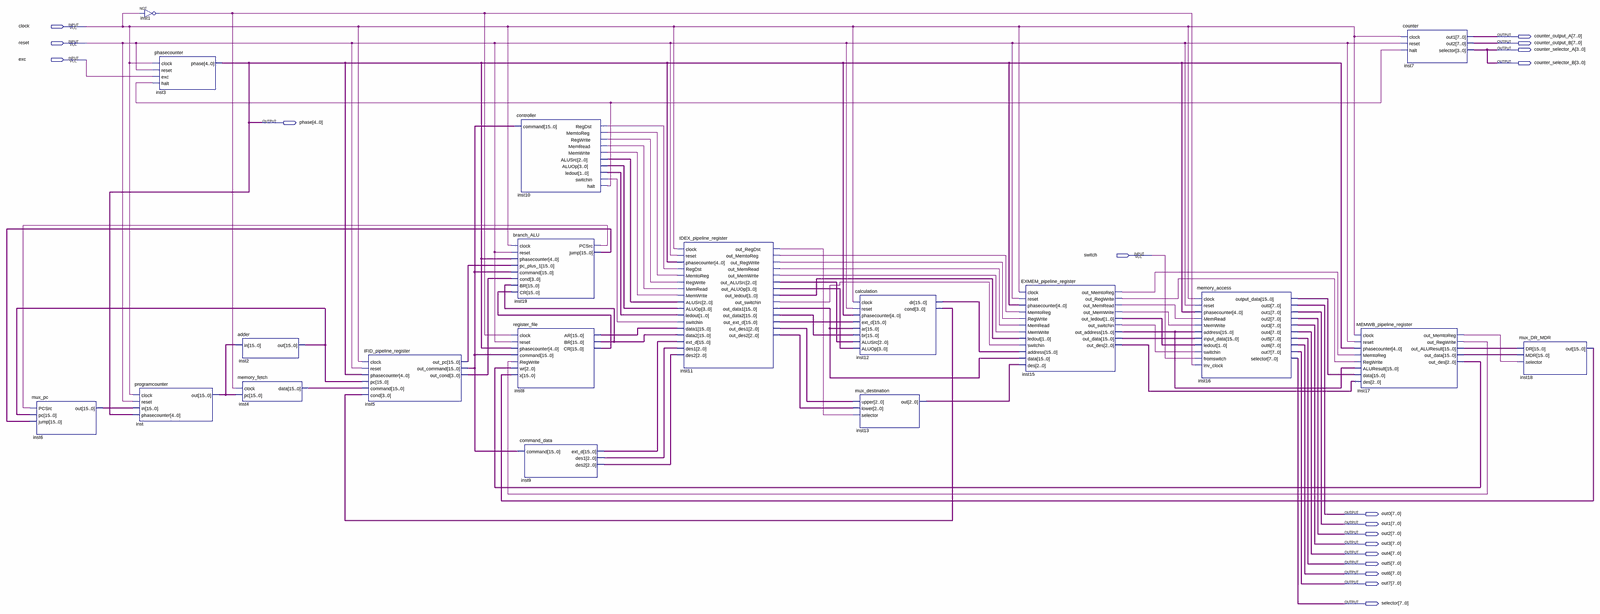
[diagram p0: schematic sheet, whole]
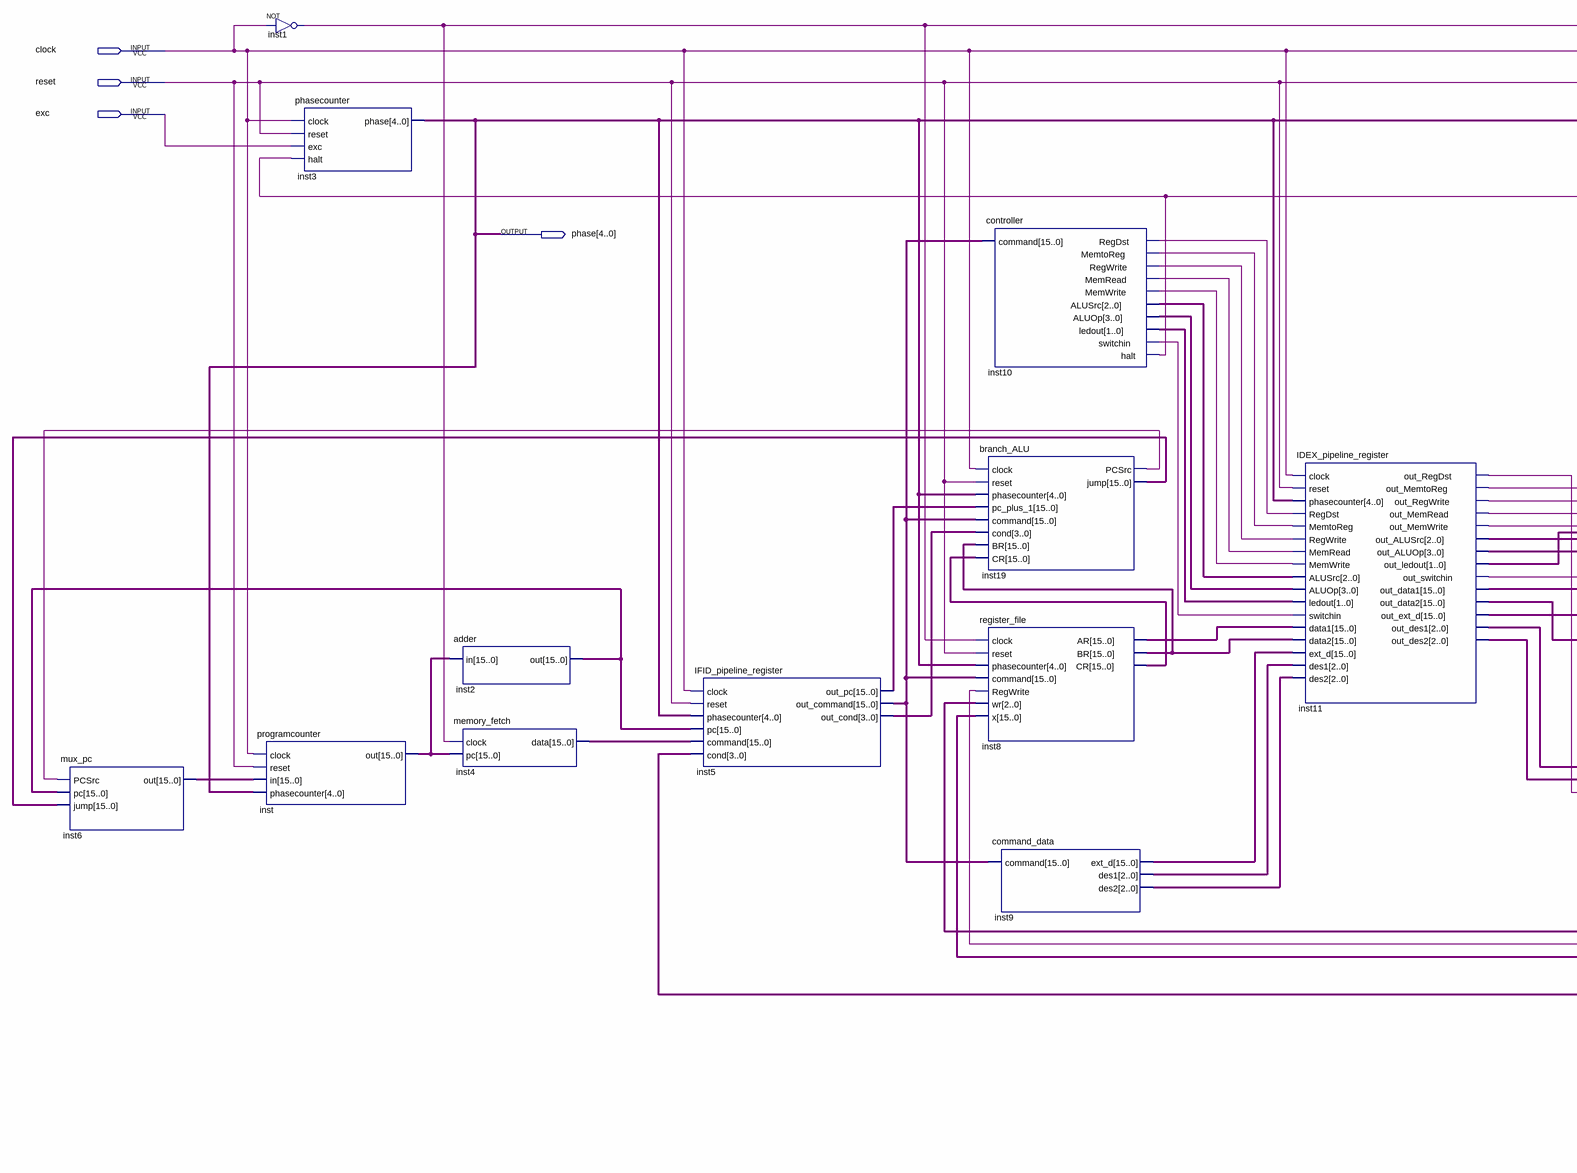
[diagram p1: schematic sheet, left part]
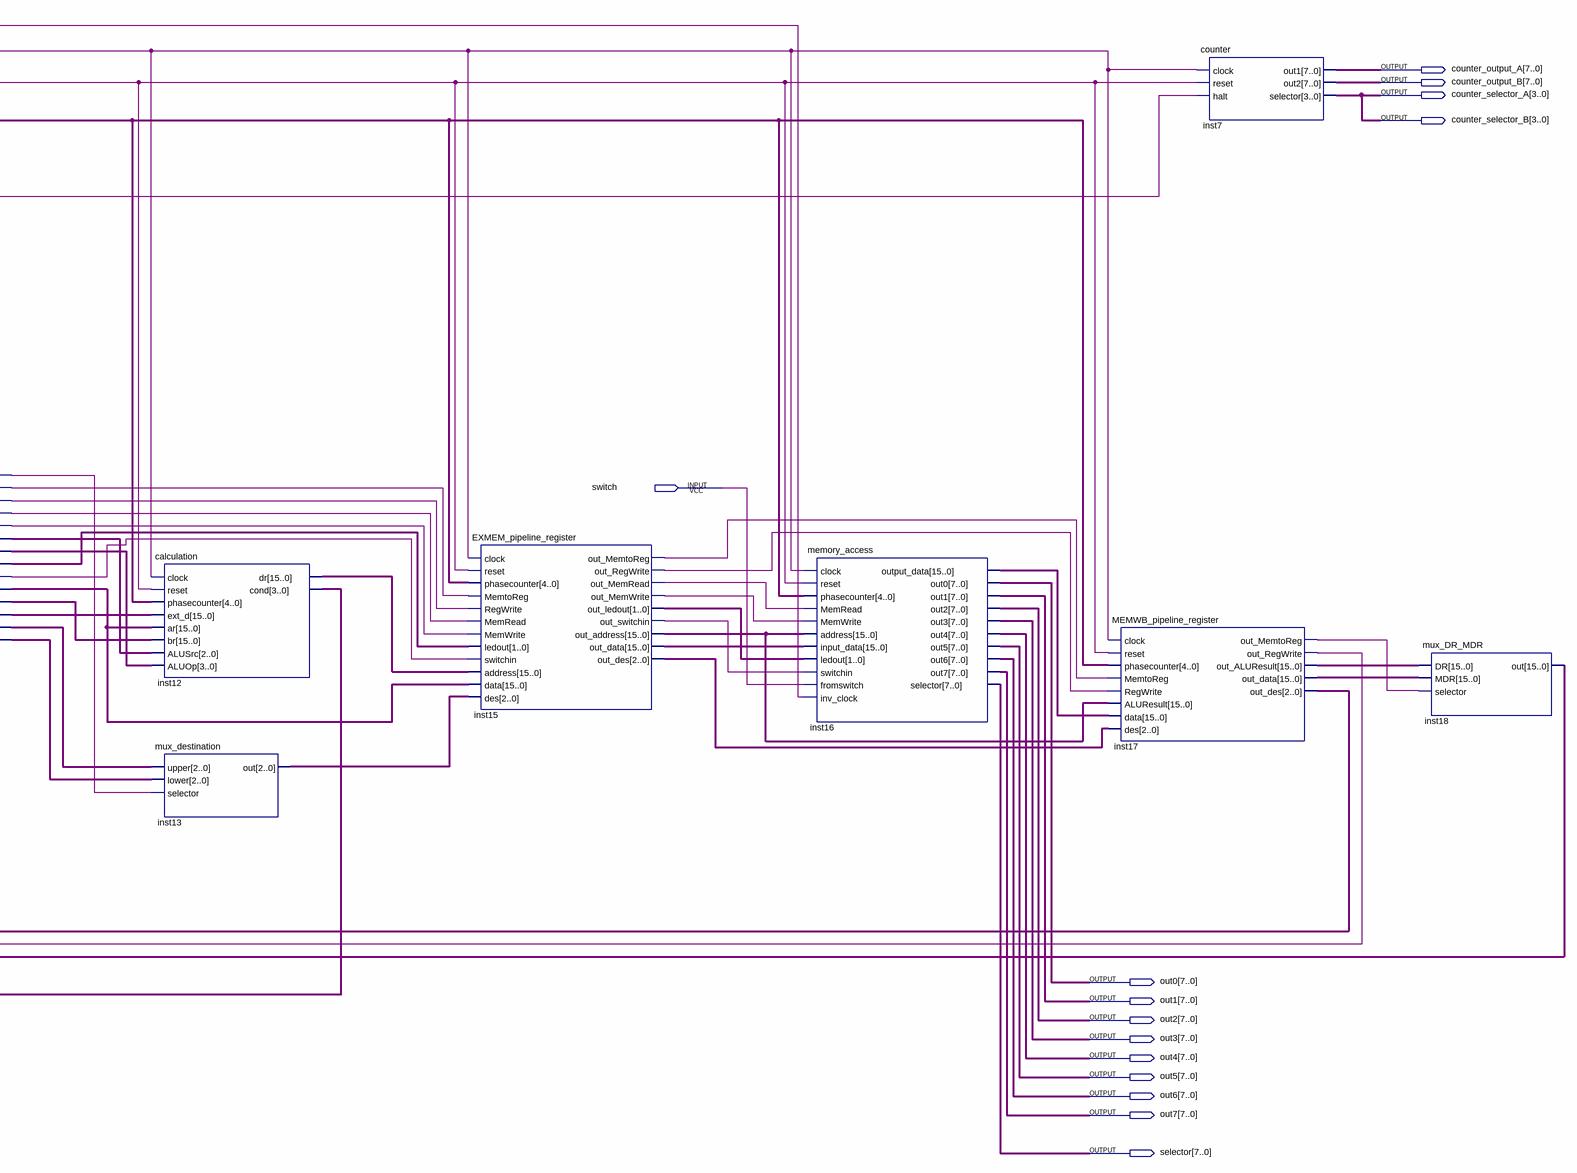
[diagram p2: schematic sheet, right part]
// Quartus schematic FINAL.bdf as structural Verilog: 19 symbols, 18 pins
module FINAL (
  input  clock,
  input  reset,
  input  exc,
  input  switch,
  output [7:0] counter_output_A,
  output [7:0] counter_output_B,
  output [3:0] counter_selector_A,
  output [3:0] counter_selector_B,
  output [4:0] phase,
  output [7:0] out0,
  output [7:0] out1,
  output [7:0] out2,
  output [7:0] out3,
  output [7:0] out4,
  output [7:0] out5,
  output [7:0] out6,
  output [7:0] out7,
  output [7:0] selector
);

  wire inst1_out, inst10_halt, inst10_memread, inst10_memtoreg, inst10_memwrite, inst10_regdst,
       inst10_regwrite, inst10_switchin, inst11_out_memread, inst11_out_memtoreg, inst11_out_memwrite,
       inst11_out_regdst, inst11_out_regwrite, inst11_out_switchin, inst15_out_memread, inst15_out_memtoreg,
       inst15_out_memwrite, inst15_out_regwrite, inst15_out_switchin, inst17_out_memtoreg,
       inst17_out_regwrite, inst19_pcsrc;
  wire [1:0] inst10_ledout, inst11_out_ledout, inst15_out_ledout;
  wire [2:0] inst9_des1, inst9_des2, inst10_alusrc, inst11_out_alusrc, inst11_out_des1, inst11_out_des2,
       inst13_out, inst15_out_des, inst17_out_des;
  wire [3:0] inst5_out_cond, inst10_aluop, inst11_out_aluop, inst12_cond;
  wire [15:0] inst2_out, inst4_data, inst5_out_command, inst5_out_pc, inst6_out, inst8_ar, inst8_br,
       inst8_cr, inst9_ext_d, inst11_out_data1, inst11_out_data2, inst11_out_ext_d, inst12_dr,
       inst15_out_address, inst15_out_data, inst16_output_data, inst17_out_aluresult, inst17_out_data,
       inst18_out, inst19_jump, inst_out;

  mux_pc inst6 (.PCSrc(inst19_pcsrc), .pc(inst2_out), .jump(inst19_jump), .out(inst6_out));
  not inst1 (inst1_out, clock);
  programcounter inst (.clock(clock), .reset(reset), .in(inst6_out), .phasecounter(phase), .out(inst_out));
  phasecounter inst3 (.clock(clock), .reset(reset), .exc(exc), .halt(inst10_halt), .phase(phase));
  adder inst2 (.in(inst_out), .out(inst2_out));
  memory_fetch inst4 (.clock(inst1_out), .pc(inst_out), .data(inst4_data));
  IFID_pipeline_register inst5 (
    .clock(clock), .reset(reset), .phasecounter(phase), .pc(inst2_out), .command(inst4_data),
    .cond(inst12_cond), .out_pc(inst5_out_pc), .out_command(inst5_out_command), .out_cond(inst5_out_cond));
  controller inst10 (
    .command(inst5_out_command), .RegDst(inst10_regdst), .MemtoReg(inst10_memtoreg),
    .RegWrite(inst10_regwrite), .MemRead(inst10_memread), .MemWrite(inst10_memwrite), .ALUSrc(inst10_alusrc),
    .ALUOp(inst10_aluop), .ledout(inst10_ledout), .switchin(inst10_switchin), .halt(inst10_halt));
  branch_ALU inst19 (
    .clock(clock), .reset(reset), .phasecounter(phase), .pc_plus_1(inst5_out_pc),
    .command(inst5_out_command), .cond(inst5_out_cond), .BR(inst8_br), .CR(inst8_cr), .PCSrc(inst19_pcsrc),
    .jump(inst19_jump));
  register_file inst8 (
    .clock(inst1_out), .reset(reset), .phasecounter(phase), .command(inst5_out_command),
    .RegWrite(inst17_out_regwrite), .wr(inst17_out_des), .x(inst18_out), .AR(inst8_ar), .BR(inst8_br),
    .CR(inst8_cr));
  command_data inst9 (.command(inst5_out_command), .ext_d(inst9_ext_d), .des1(inst9_des1), .des2(inst9_des2));
  IDEX_pipeline_register inst11 (
    .clock(clock), .reset(reset), .phasecounter(phase), .RegDst(inst10_regdst), .MemtoReg(inst10_memtoreg),
    .RegWrite(inst10_regwrite), .MemRead(inst10_memread), .MemWrite(inst10_memwrite), .ALUSrc(inst10_alusrc),
    .ALUOp(inst10_aluop), .ledout(inst10_ledout), .switchin(inst10_switchin), .data1(inst8_ar),
    .data2(inst8_br), .ext_d(inst9_ext_d), .des1(inst9_des1), .des2(inst9_des2),
    .out_RegDst(inst11_out_regdst), .out_MemtoReg(inst11_out_memtoreg), .out_RegWrite(inst11_out_regwrite),
    .out_MemRead(inst11_out_memread), .out_MemWrite(inst11_out_memwrite), .out_ALUSrc(inst11_out_alusrc),
    .out_ALUOp(inst11_out_aluop), .out_ledout(inst11_out_ledout), .out_switchin(inst11_out_switchin),
    .out_data1(inst11_out_data1), .out_data2(inst11_out_data2), .out_ext_d(inst11_out_ext_d),
    .out_des1(inst11_out_des1), .out_des2(inst11_out_des2));
  calculation inst12 (
    .clock(clock), .reset(reset), .phasecounter(phase), .ext_d(inst11_out_ext_d), .ar(inst11_out_data1),
    .br(inst11_out_data2), .ALUSrc(inst11_out_alusrc), .ALUOp(inst11_out_aluop), .dr(inst12_dr),
    .cond(inst12_cond));
  mux_destination inst13 (
    .upper(inst11_out_des1), .lower(inst11_out_des2), .selector(inst11_out_regdst), .out(inst13_out));
  EXMEM_pipeline_register inst15 (
    .clock(clock), .reset(reset), .phasecounter(phase), .MemtoReg(inst11_out_memtoreg),
    .RegWrite(inst11_out_regwrite), .MemRead(inst11_out_memread), .MemWrite(inst11_out_memwrite),
    .ledout(inst11_out_ledout), .switchin(inst11_out_switchin), .address(inst12_dr), .data(inst11_out_data1),
    .des(inst13_out), .out_MemtoReg(inst15_out_memtoreg), .out_RegWrite(inst15_out_regwrite),
    .out_MemRead(inst15_out_memread), .out_MemWrite(inst15_out_memwrite), .out_ledout(inst15_out_ledout),
    .out_switchin(inst15_out_switchin), .out_address(inst15_out_address), .out_data(inst15_out_data),
    .out_des(inst15_out_des));
  memory_access inst16 (
    .clock(clock), .reset(reset), .phasecounter(phase), .MemRead(inst15_out_memread),
    .MemWrite(inst15_out_memwrite), .address(inst15_out_address), .input_data(inst15_out_data),
    .ledout(inst15_out_ledout), .switchin(inst15_out_switchin), .fromswitch(switch), .inv_clock(inst1_out),
    .output_data(inst16_output_data), .out0(out0), .out1(out1), .out2(out2), .out3(out3), .out4(out4),
    .out5(out5), .out6(out6), .out7(out7), .selector(selector));
  MEMWB_pipeline_register inst17 (
    .clock(clock), .reset(reset), .phasecounter(phase), .MemtoReg(inst15_out_memtoreg),
    .RegWrite(inst15_out_regwrite), .ALUResult(inst15_out_address), .data(inst16_output_data),
    .des(inst15_out_des), .out_MemtoReg(inst17_out_memtoreg), .out_RegWrite(inst17_out_regwrite),
    .out_ALUResult(inst17_out_aluresult), .out_data(inst17_out_data), .out_des(inst17_out_des));
  counter inst7 (
    .clock(clock), .reset(reset), .halt(inst10_halt), .out1(counter_output_A), .out2(counter_output_B),
    .selector(counter_selector_A));
  mux_DR_MDR inst18 (
    .DR(inst17_out_aluresult), .MDR(inst17_out_data), .selector(inst17_out_memtoreg), .out(inst18_out));

  assign counter_selector_B = counter_selector_A;
endmodule
